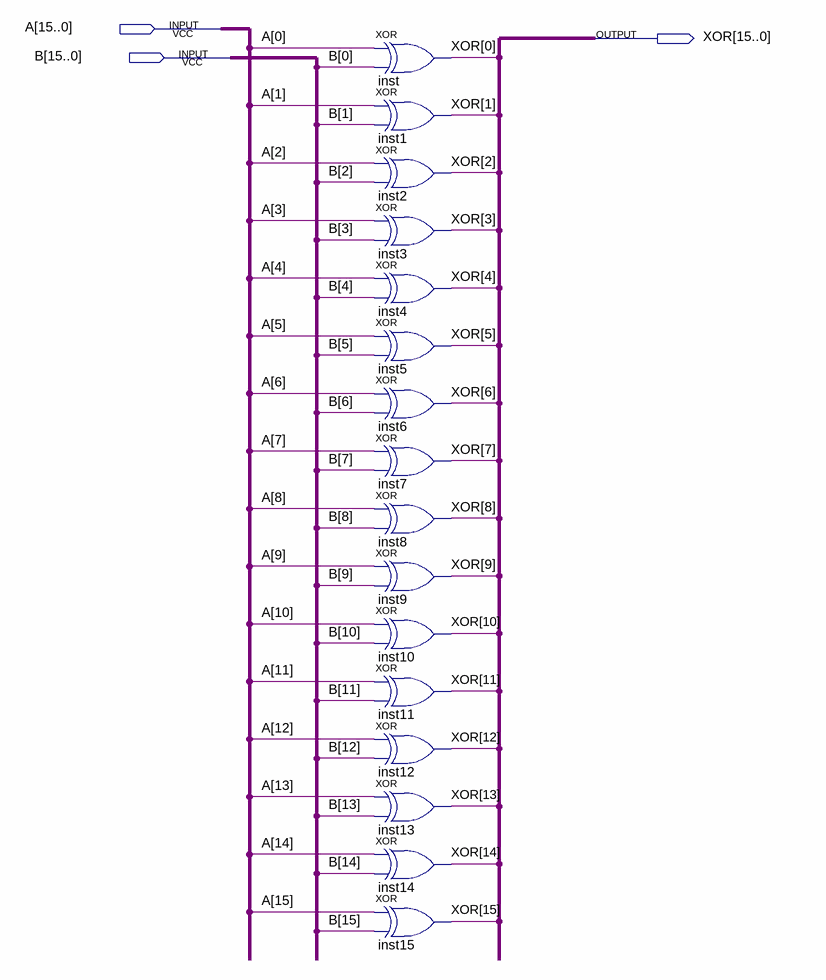
[diagram p0: schematic sheet]
// Quartus schematic XOR_16BIT.bdf as structural Verilog: 16 symbols, 3 pins
module XOR_16BIT (
  input  [15:0] A,
  input  [15:0] B,
  output [15:0] XOR
);

  xor inst (XOR[0], A[0], B[0]);
  xor inst1 (XOR[1], A[1], B[1]);
  xor inst2 (XOR[2], A[2], B[2]);
  xor inst3 (XOR[3], A[3], B[3]);
  xor inst4 (XOR[4], A[4], B[4]);
  xor inst5 (XOR[5], A[5], B[5]);
  xor inst6 (XOR[6], A[6], B[6]);
  xor inst7 (XOR[7], A[7], B[7]);
  xor inst8 (XOR[8], A[8], B[8]);
  xor inst9 (XOR[9], A[9], B[9]);
  xor inst10 (XOR[10], A[10], B[10]);
  xor inst11 (XOR[11], A[11], B[11]);
  xor inst12 (XOR[12], A[12], B[12]);
  xor inst13 (XOR[13], A[13], B[13]);
  xor inst14 (XOR[14], A[14], B[14]);
  xor inst15 (XOR[15], A[15], B[15]);
endmodule
